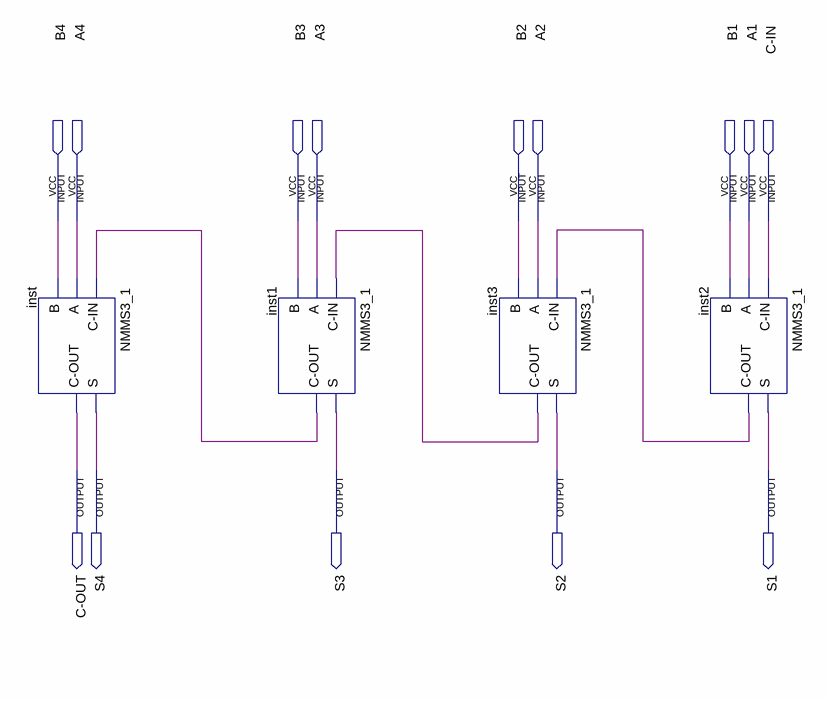
[diagram p0: schematic sheet]
// Quartus schematic NMMS3_2.bdf as structural Verilog: 4 symbols, 14 pins
module NMMS3_2 (
  input  B4,
  input  A4,
  input  B3,
  input  A3,
  input  B2,
  input  A2,
  input  B1,
  input  A1,
  input  \C-IN ,
  output \C-OUT ,
  output S4,
  output S3,
  output S2,
  output S1
);

  wire inst1_c_out, inst2_c_out, inst3_c_out;

  NMMS3_1 inst (.\C-IN (inst1_c_out), .A(A4), .B(B4), .S(S4), .\C-OUT (\C-OUT ));
  NMMS3_1 inst1 (.\C-IN (inst3_c_out), .A(A3), .B(B3), .S(S3), .\C-OUT (inst1_c_out));
  NMMS3_1 inst3 (.\C-IN (inst2_c_out), .A(A2), .B(B2), .S(S2), .\C-OUT (inst3_c_out));
  NMMS3_1 inst2 (.\C-IN (\C-IN ), .A(A1), .B(B1), .S(S1), .\C-OUT (inst2_c_out));
endmodule
